# Altium schematic sheet AD717-2.SchDoc
size Tabloid; Organization: Altium Limited; Address1: L3, 12a Rodborough Rd; Address2: Frenchs Forest; Address3: NSW; Address4: Australia 2086
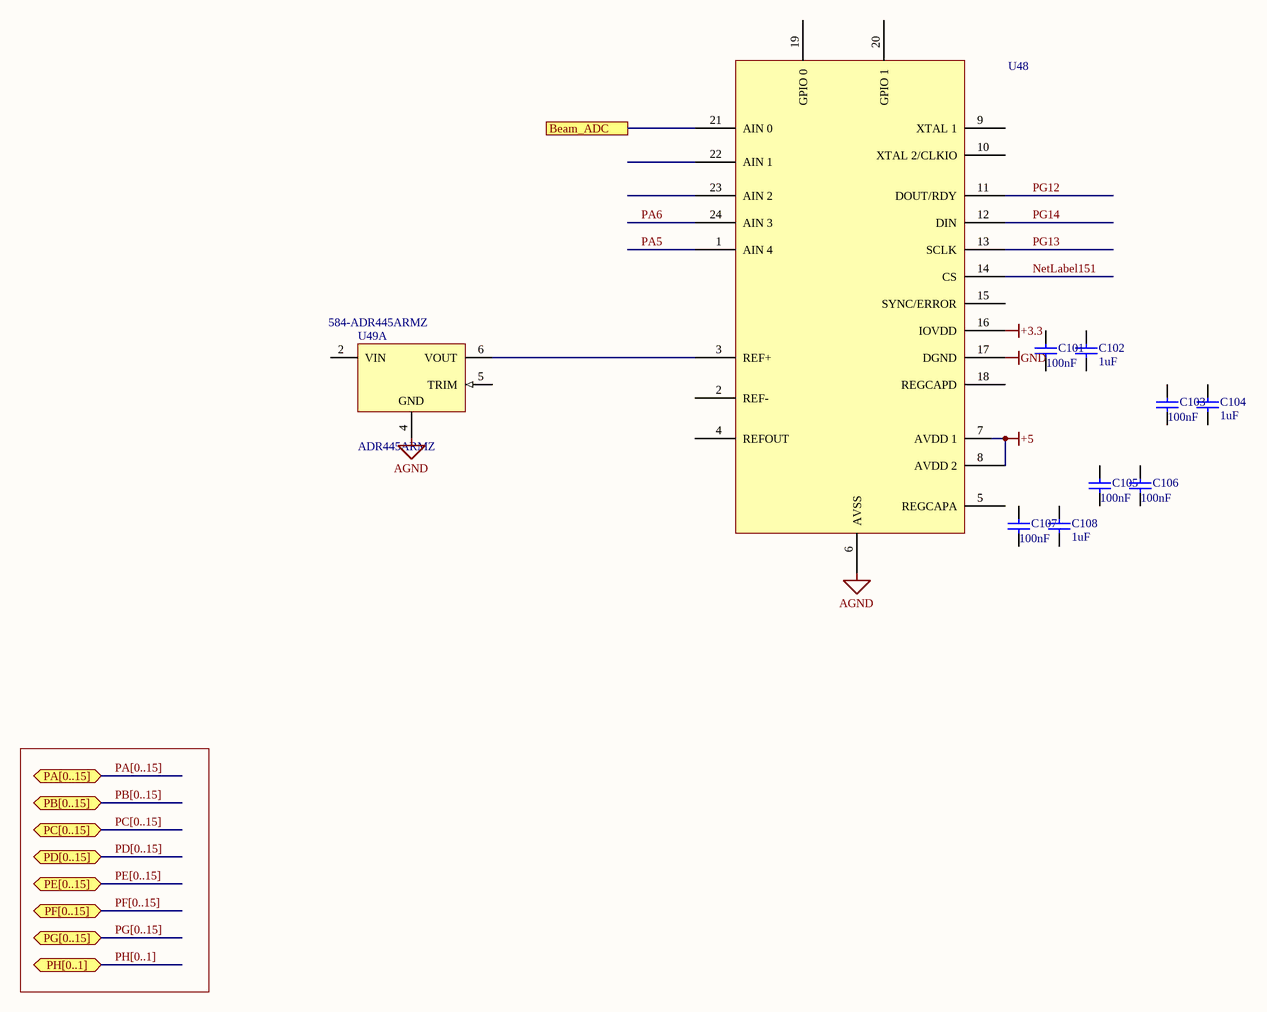
[diagram p0: AD717-2.SchDoc]

## Parts
C101  Capacitance: 100nF  [C0402]  (hidden comment: Capacitor)
C102  value 1uF  [C0603]  (hidden comment: Capacitor)
C103  Capacitance: 100nF  [C0402]  (hidden comment: Capacitor)
C104  value 1uF  [C0603]  (hidden comment: Capacitor)
C105  Capacitance: 100nF  [C0402]  (hidden comment: Capacitor)
C106  Capacitance: 100nF  [C0402]  (hidden comment: Capacitor)
C107  Capacitance: 100nF  [C0402]  (hidden comment: Capacitor)
C108  value 1uF  [C0603]  (hidden comment: Capacitor)
U48  AD7177-2  [AD7177-2BRUZ]  (value not drawn)
U49  ADR445ARMZ  Supplier Part Number 1: 584-ADR445ARMZ  [ADI-RM-8_M]  (part A of 2)

## Ports
Beam_ADC, PA[0..15] (bidir), PB[0..15] (bidir), PC[0..15] (bidir), PD[0..15] (bidir), PE[0..15] (bidir), PF[0..15] (bidir), PG[0..15] (bidir), PH[0..1] (bidir)

## Nets
+3.3: U48.16(IOVDD)
+5: U48.7(AVDD_1) U48.8(AVDD_2)
AGND: U48.6(AVSS) U49.4(GND)
GND: U48.17(DGND)
Beam_ADC: U48.21(AIN_0) ; port Beam_ADC
NetLabel151: U48.14(CS)
PA5: U48.1(AIN_4)
PA6: U48.24(AIN_3)
PG12: U48.11(DOUT/RDY)
PG13: U48.13(SCLK)
PG14: U48.12(DIN)
NetU48_3: U48.3(REF+) U49.6(VOUT)

Not connected (* = marked no-connect by the designer): C101 1 2; C102 1 2; C103 1 2; C104 1 2; C105 1 2; C106 1 2; C107 1 2; C108 1 2; U48 2(REF-) 4(REFOUT) 5(REGCAPA) 9(XTAL_1) 10(XTAL_2/CLKIO) 15(SYNC/ERROR) 18(REGCAPD) 19(GPIO_0) 20(GPIO_1) 22(AIN_1) 23(AIN_2); U49 2(VIN) 5(TRIM)

## Buses and harness runs
bus PA[0..15] = port PA[0..15]
bus PB[0..15] = port PB[0..15]
bus PC[0..15] = port PC[0..15]
bus PD[0..15] = port PD[0..15]
bus PE[0..15] = port PE[0..15]
bus PF[0..15] = port PF[0..15]
bus PG[0..15] = port PG[0..15]
bus PH[0..1] = port PH[0..1]

## Notes on the sheet
- Title
- Size:
- Date:
- Tabloid
- Number:
- Time:
- Revision:
- Sheet
- of
- File:

## Library data of the parts
C101 C103 C105-C107 = MCD-01123: CAP CER 0.1UF 16V X7R 0402; Manufacturer: Yageo; Manufacturer Part Number: CC0402KRX7R7BB104; Tolerance: 10%; Supplier 1: Mouser; Supplier Part Number 1: 603-CC402KRX7R7BB104; Stock 1: 164534511; Pricing 1: 1=0.10000, 10=0.02700, 50=0.02700, 100=0.01200, 1000=0.00700, 2500=0.00600, 10000=0.00500, 20000=0.00400 (USD); RoHS: Yes; Mount: Surface Mount; Case/Package: 0402; Number of Pins: 2; Case Code (Metric): 1005; Case Code (Imperial): 0402; Min Operating Temperature: -55°C; Max Operating Temperature: 125°C; Dielectric: X7R; Voltage Rating: 16V; Voltage Rating (DC): 16V; Packaging: Tape and Reel; Package Quantity: 1; Termination: SMD/SMT; Composition: Ceramic; Voltage: 16V; Length: 1mm; Height: 0.5mm; Width: 0.02inch; Thickness: 0.022inch; Depth: 0.5mm; Radiation Hardening: No; REACH SVHC: No SVHC; Lead Free: Lead Free; Halogen Free: Halogen Free; ComponentLink1URL: https://datasheet.ciiva.com/11788/0900766b80ce67ed-11788364.pdf?src-supplier=RSComponents; ComponentLink1Description: https://datasheet.ciiva.com/11788/0900766b80ce67ed-11788364.pdf?src-supplier=RSComponents; ComponentLink2URL: https://datasheet.ciiva.com/16625/upy-gphc-x7r-6-3v-to-50v-8-16625511.pdf?src-supplier=Avnet+Europe; ComponentLink2Description: https://datasheet.ciiva.com/16625/upy-gphc-x7r-6-3v-to-50v-8-16625511.pdf?src-supplier=Avnet+Europe; ComponentLink3URL: https://datasheet.ciiva.com/161/mlccorderingcode-161544.pdf?src-supplier=Digi-Key; ComponentLink3Description: https://datasheet.ciiva.com/161/mlccorderingcode-161544.pdf?src-supplier=Digi-Key; ComponentLink4URL: https://datasheet.ciiva.com/11587/upy-gphc-x7r-6-3v-to-50v-8-11587305.pdf?src-supplier=Avnet; ComponentLink4Description: https://datasheet.ciiva.com/11587/upy-gphc-x7r-6-3v-to-50v-8-11587305.pdf?src-supplier=Avnet; ComponentLink5URL: https://datasheet.ciiva.com/161/mlccorderingcode-161546.pdf?src-supplier=Digi-Key; ComponentLink5Description: https://datasheet.ciiva.com/161/mlccorderingcode-161546.pdf?src-supplier=Digi-Key; ComponentLink6URL: https://datasheet.ciiva.com/7978/1489800-7978111.pdf?src-supplier=Element14; ComponentLink6Description: https://datasheet.ciiva.com/7978/1489800-7978111.pdf?src-supplier=Element14; ComponentLink7URL: https://datasheet.ciiva.com/161/mlccorderingcode-161545.pdf?src-supplier=Digi-Key; ComponentLink7Description: https://datasheet.ciiva.com/161/mlccorderingcode-161545.pdf?src-supplier=Digi-Key; ComponentLink8URL: https://datasheet.ciiva.com/13395/upy-gphc-x7r-6-3v-to-50v-8-13395676.pdf?src-supplier=Mouser; ComponentLink8Description: https://datasheet.ciiva.com/13395/upy-gphc-x7r-6-3v-to-50v-8-13395676.pdf?src-supplier=Mouser; ComponentLink9URL: https://datasheet.ciiva.com/8033/1734573-8033661.pdf?src-supplier=Element14; ComponentLink9Description: https://datasheet.ciiva.com/8033/1734573-8033661.pdf?src-supplier=Element14; ComponentLink10URL: https://datasheet.ciiva.com/8033/1734573-8033663.pdf?src-supplier=Element14; ComponentLink10Description: https://datasheet.ciiva.com/8033/1734573-8033663.pdf?src-supplier=Element14; ComponentLink11URL: https://datasheet.ciiva.com/28450/1489800-28450335.pdf?src-supplier=Element14; ComponentLink11Description: https://datasheet.ciiva.com/28450/1489800-28450335.pdf?src-supplier=Element14
C102 C104 C108 = MCD-00238: Capacitor, MLCC, 1uF, 6V3, X5R, 10%, 0603, T=0,8mm; Manufacturer_Part_Number: CC0603KRX5R5BB105; Manufacturer: YAGEO; Provided_By: SUBCO; ECCN_US: EAR99; ECCN_EU: NEC; Internal_Part_Number: MCD-00238; ComponentLink1Description: Datasheet; Status: Released; Part_Type: Capacitor; Package: C0603; ComponentLink1URL: http://tunmcdsvn.tun.st.com/Component_Datasheet_Library/Trunk/Capacitors/Yageo_Multilayer_capacitor_X5R_series_100pF_to_100uF
U49 = CMP-0784-00380-1: Ultralow Noise, LDO XFET Voltage Reference with Current Sink and Source, 5 V Output, 5.5 to 18 V Supply, Industrial, 8-pin SOP (RM-8), Tube; Manufacturer: Analog Devices; Min V Supply (V): 5.5; Vout: 5V; Ref Out TC (ppm/C): 2; Max V Supply (V): 18; Max Input Voltage: 20V; Max Output Current: 10mA; Operating Supply Current: 3.75mA; Temperature Coefficient: 10ppm/°C; Reference Type: Series; Tolerance: 0.12%; Output Type: Fixed; Min Input Voltage: 5.5V; ComponentLink2Description: Datasheet; ComponentLink1URL: http://www.analog.com/en/index.html; Packing: Tube; ComponentLink2URL: http://www.analog.com/static/imported-files/data_sheets/ADR440_441_443_444_445.pdf; ComponentLink1Description: Manufacturer URL; Mounting Technology: Surface Mount; DatasheetVersion: Rev. E; PackageReference: RM-8; ComponentLink4URL: Product URL:http://www.analog.com/en/special-linear-functions/voltage-references/adr445/products/product.html; Operating Temp Range: -40 to 125 degC; PackageDescription: 8-Pin Mini Small Outline Package, Body 3 x 3 mm, Pitch 0.65 mm; PackageVersion: Aug-05; Code_JEDEC: MO-187-AA; PartNumber: ADR445ARMZ; ComponentLink3URL: http://www.analog.com/static/imported-files/packages/PKG_PDF/MSOP%28RM%29/RM_8.pdf; ComponentLink3Description: Package Specification; ComponentLink4Description: URL Link1; Supplier 1: Mouser; Manufacturer Part Number: ADR445ARMZ; Stock 1: 815; Pricing 1: 1=6.24000, 10=5.61000, 25=5.28000, 50=4.96000, 100=4.71000, 250=4.43000, 500=4.02000, 1000=3.44000, 2500=3.40000, 10000=3.44000 (USD); RoHS: Yes; Case/Package: MSOP; Number of Pins: 8; Min Operating Temperature: -40°C; Max Operating Temperature: 125°C; Output Voltage: 5V; Packaging: Rail/Tube; Package Quantity: 50; Min Output Voltage: 5V; Output Current: 10mA; Max Output Voltage: 5V; Nominal Supply Current: 3.75mA; Current Rating: 3.75mA; Reference Voltage: 5V; Length: 3mm; Height: 0.85mm; Width: 3mm; Radiation Hardening: No; Lead Free: Contains Lead; REACH SVHC: No SVHC; ComponentLink5URL: https://datasheet.ciiva.com/26887/adr445armz-26887930.pdf?src-supplier=IIIC; ComponentLink5Description: https://datasheet.ciiva.com/26887/adr445armz-26887930.pdf?src-supplier=IIIC; ComponentLink6URL: https://datasheet.ciiva.com/15373/adr440-441-443-444-445-279233-15373198.pdf?src-supplier=Mouser; ComponentLink6Description: https://datasheet.ciiva.com/15373/adr440-441-443-444-445-279233-15373198.pdf?src-supplier=Mouser; ComponentLink7URL: https://datasheet.ciiva.com/2008/adr440-441-443-444-445-2008927.pdf?src-supplier=Digi-Key; ComponentLink7Description: https://datasheet.ciiva.com/2008/adr440-441-443-444-445-2008927.pdf?src-supplier=Digi-Key; ComponentLink8URL: https://datasheet.ciiva.com/1172/1048061-1172739.pdf?src-supplier=Element14; ComponentLink8Description: https://datasheet.ciiva.com/1172/1048061-1172739.pdf?src-supplier=Element14; ComponentLink9URL: https://datasheet.ciiva.com/3235/adr440-441-443-444-445-3235286.pdf?src-supplier=Avnet; ComponentLink9Description: https://datasheet.ciiva.com/3235/adr440-441-443-444-445-3235286.pdf?src-supplier=Avnet; ComponentLink10URL: https://datasheet.ciiva.com/17219/adr440-441-443-444-445-17219117.pdf?src-supplier=Avnet+Europe; ComponentLink10Description: https://datasheet.ciiva.com/17219/adr440-441-443-444-445-17219117.pdf?src-supplier=Avnet+Europe